# EAGLE design tree2 (EAGLE 9.6.0)
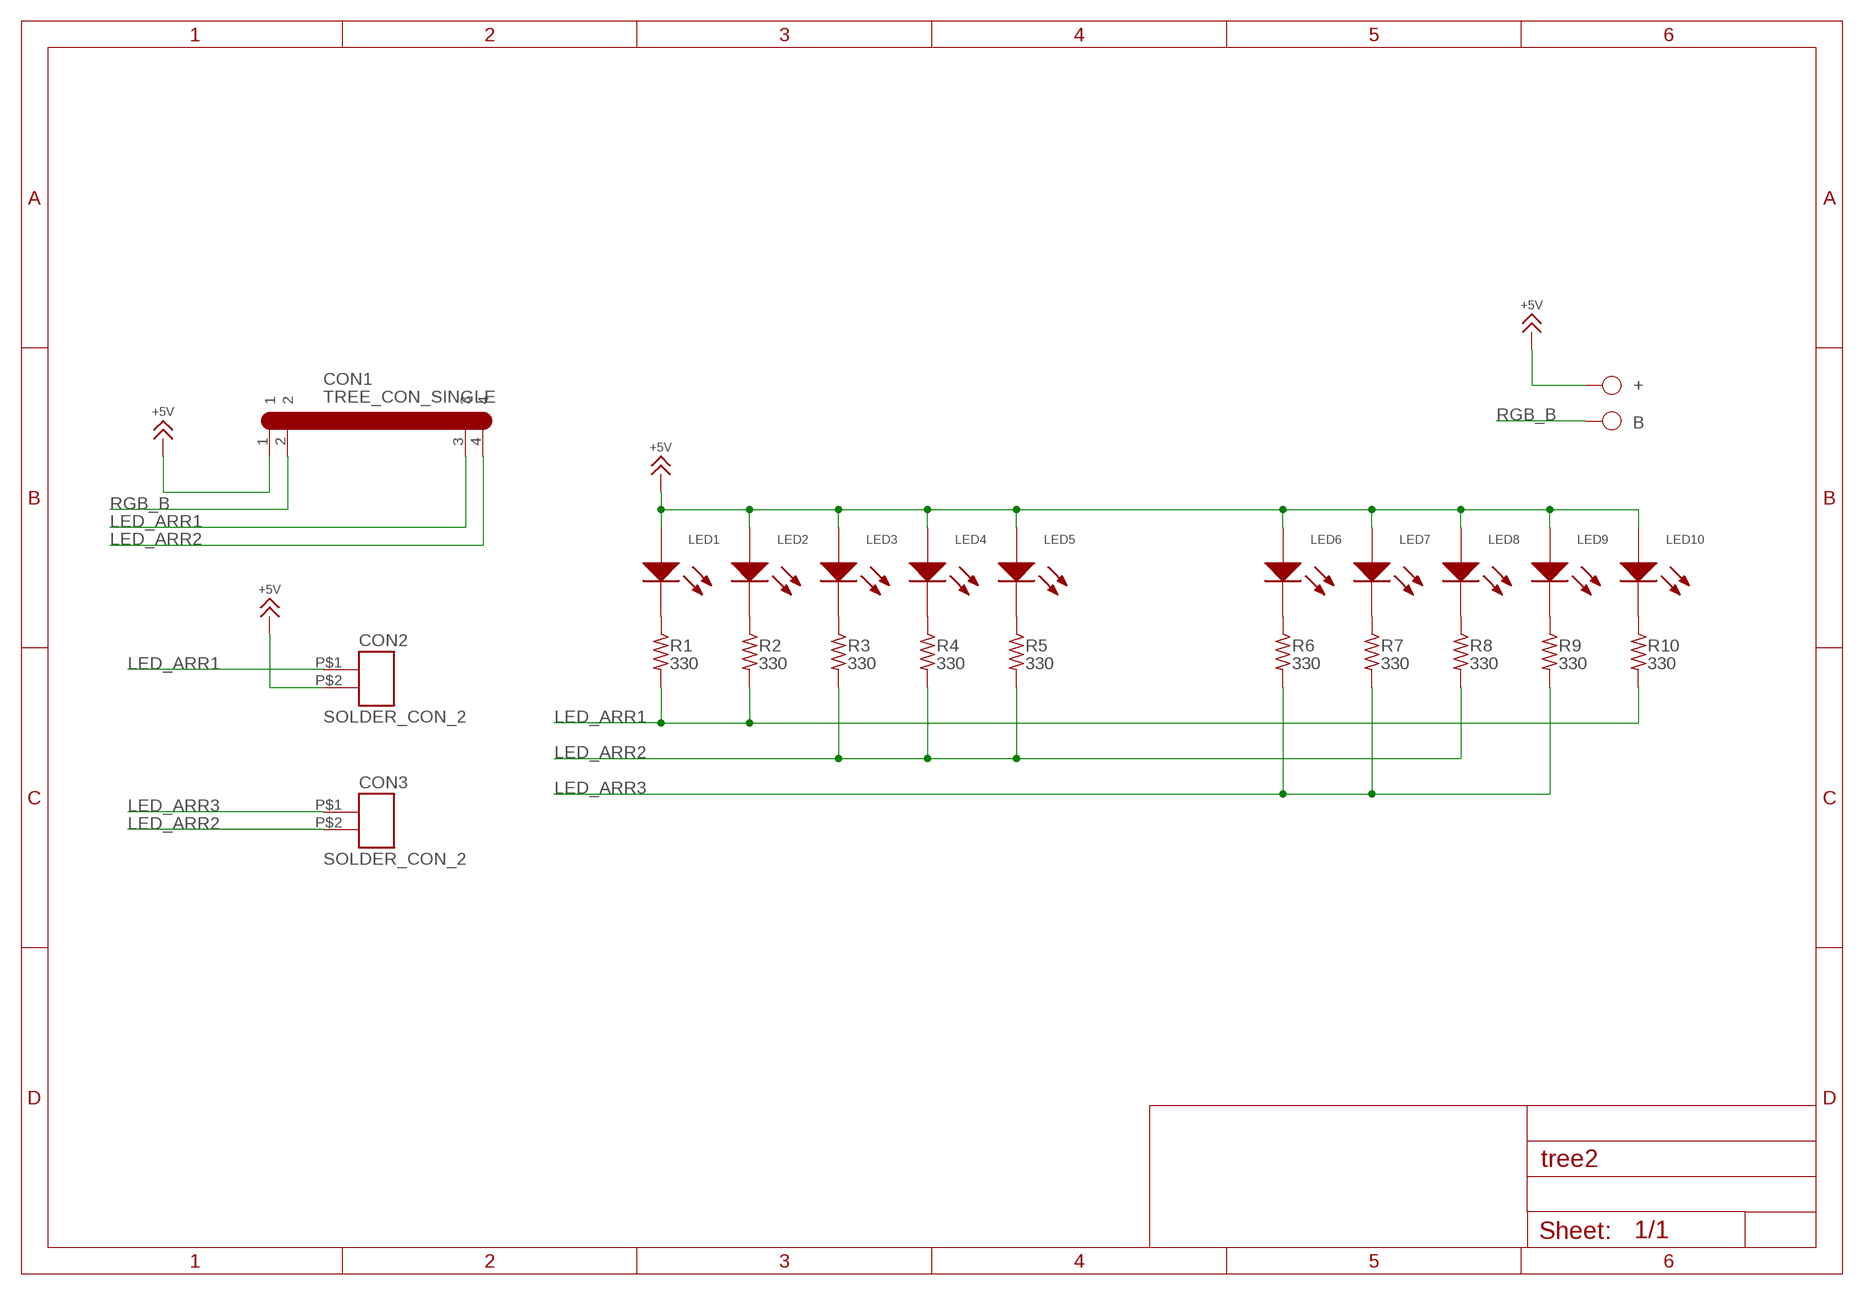
[diagram p0: schematic, sheet 1]

## Parts
+  TP  [TP]
B  TP  [TP]
CON1  TREE_CON_SINGLE  [TREE_CON_SINGLE]
CON2  SOLDER_CON_2  [SOLDER_CON_2]
CON3  SOLDER_CON_2  [SOLDER_CON_2]
LED1  LED_BEN  [LED_5MM_BEN]
LED2  LED_BEN  [LED_5MM_BEN]
LED3  LED_BEN  [LED_5MM_BEN]
LED4  LED_BEN  [LED_5MM_BEN]
LED5  LED_BEN  [LED_5MM_BEN]
LED6  LED_BEN  [LED_5MM_BEN]
LED7  LED_BEN  [LED_5MM_BEN]
LED8  LED_BEN  [LED_5MM_BEN]
LED9  LED_BEN  [LED_5MM_BEN]
LED10  LED_BEN  [LED_5MM_BEN]
R1  330  RES_2012  [SMD2012]
R2  330  RES_2012  [SMD2012]
R3  330  RES_2012  [SMD2012]
R4  330  RES_2012  [SMD2012]
R5  330  RES_2012  [SMD2012]
R6  330  RES_2012  [SMD2012]
R7  330  RES_2012  [SMD2012]
R8  330  RES_2012  [SMD2012]
R9  330  RES_2012  [SMD2012]
R10  330  RES_2012  [SMD2012]

## Nets
+5V [POWER]: +.1 CON1.1 CON2.P$2 LED1.1 LED2.1 LED3.1 LED4.1 LED5.1 LED6.1 LED7.1 LED8.1 LED9.1 LED10.1
LED_ARR1: CON1.3 CON2.P$1 R1.2 R2.2 R10.2
LED_ARR2: CON1.4 CON3.P$2 R3.2 R4.2 R5.2 R8.2
LED_ARR3: CON3.P$1 R6.2 R7.2 R9.2
N$1: LED1.2 R1.1
N$2: LED2.2 R2.1
N$3: LED3.2 R3.1
N$4: LED4.2 R4.1
N$5: LED5.2 R5.1
N$6: LED6.2 R6.1
N$7: LED7.2 R7.1
N$8: LED8.2 R8.1
N$9: LED9.2 R9.1
N$10: LED10.2 R10.1
RGB_B: B.1 CON1.2

## Library data of the parts
+ B = !JKS:TP
CON1 = !JKS:TREE_CON_SINGLE
CON2 CON3 = !JKS:SOLDER_CON_2
LED1-LED10 = !JKS:LED
R1-R10 = !JKS:RES

## Net classes
0 default: width 0.254 mm
1 POWER: width 0.3 mm

## Board
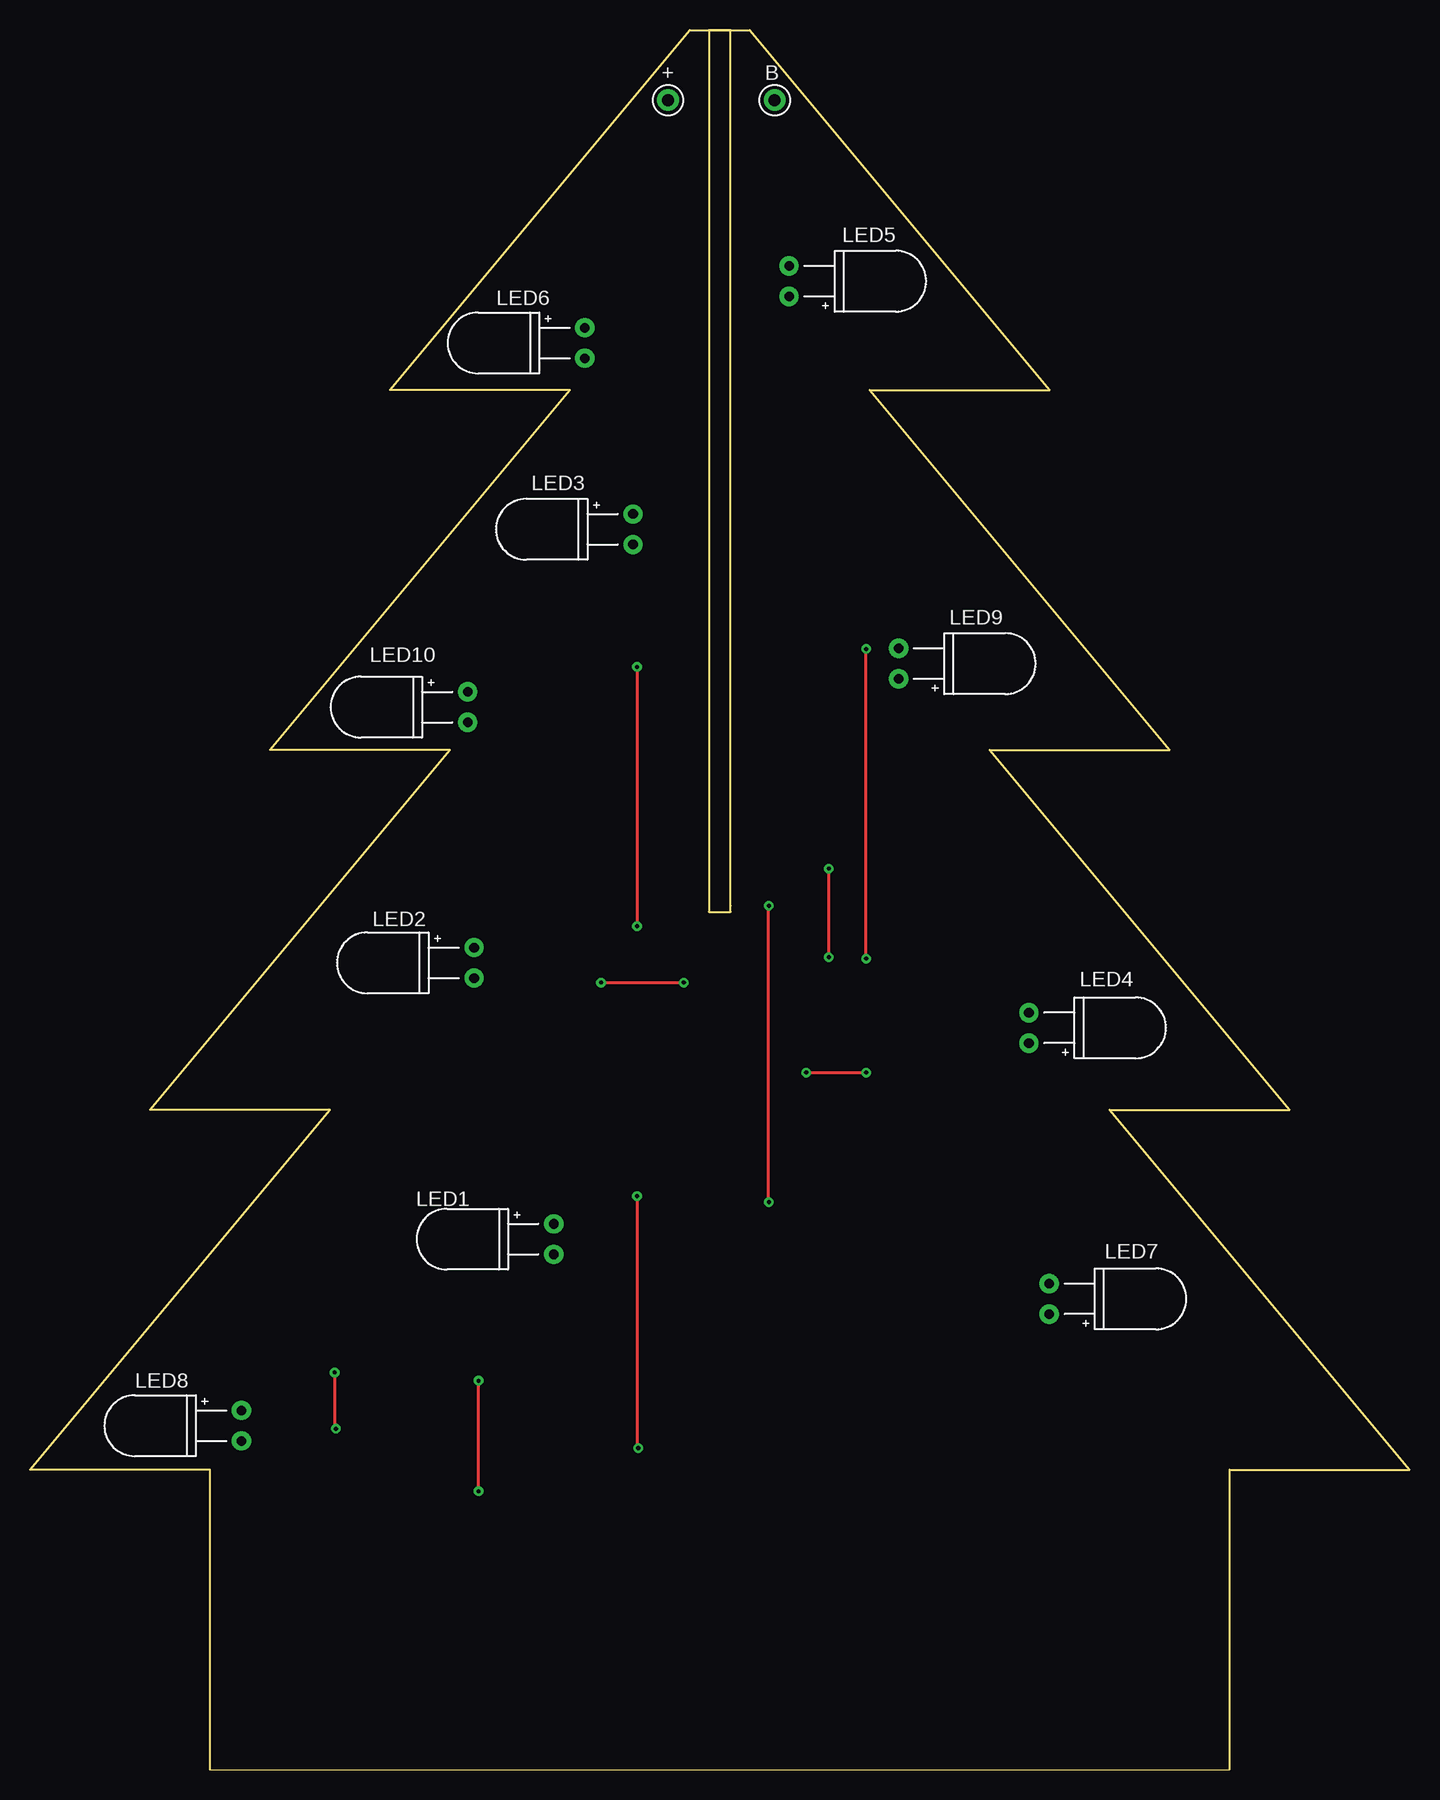
[diagram p1: board, top side]
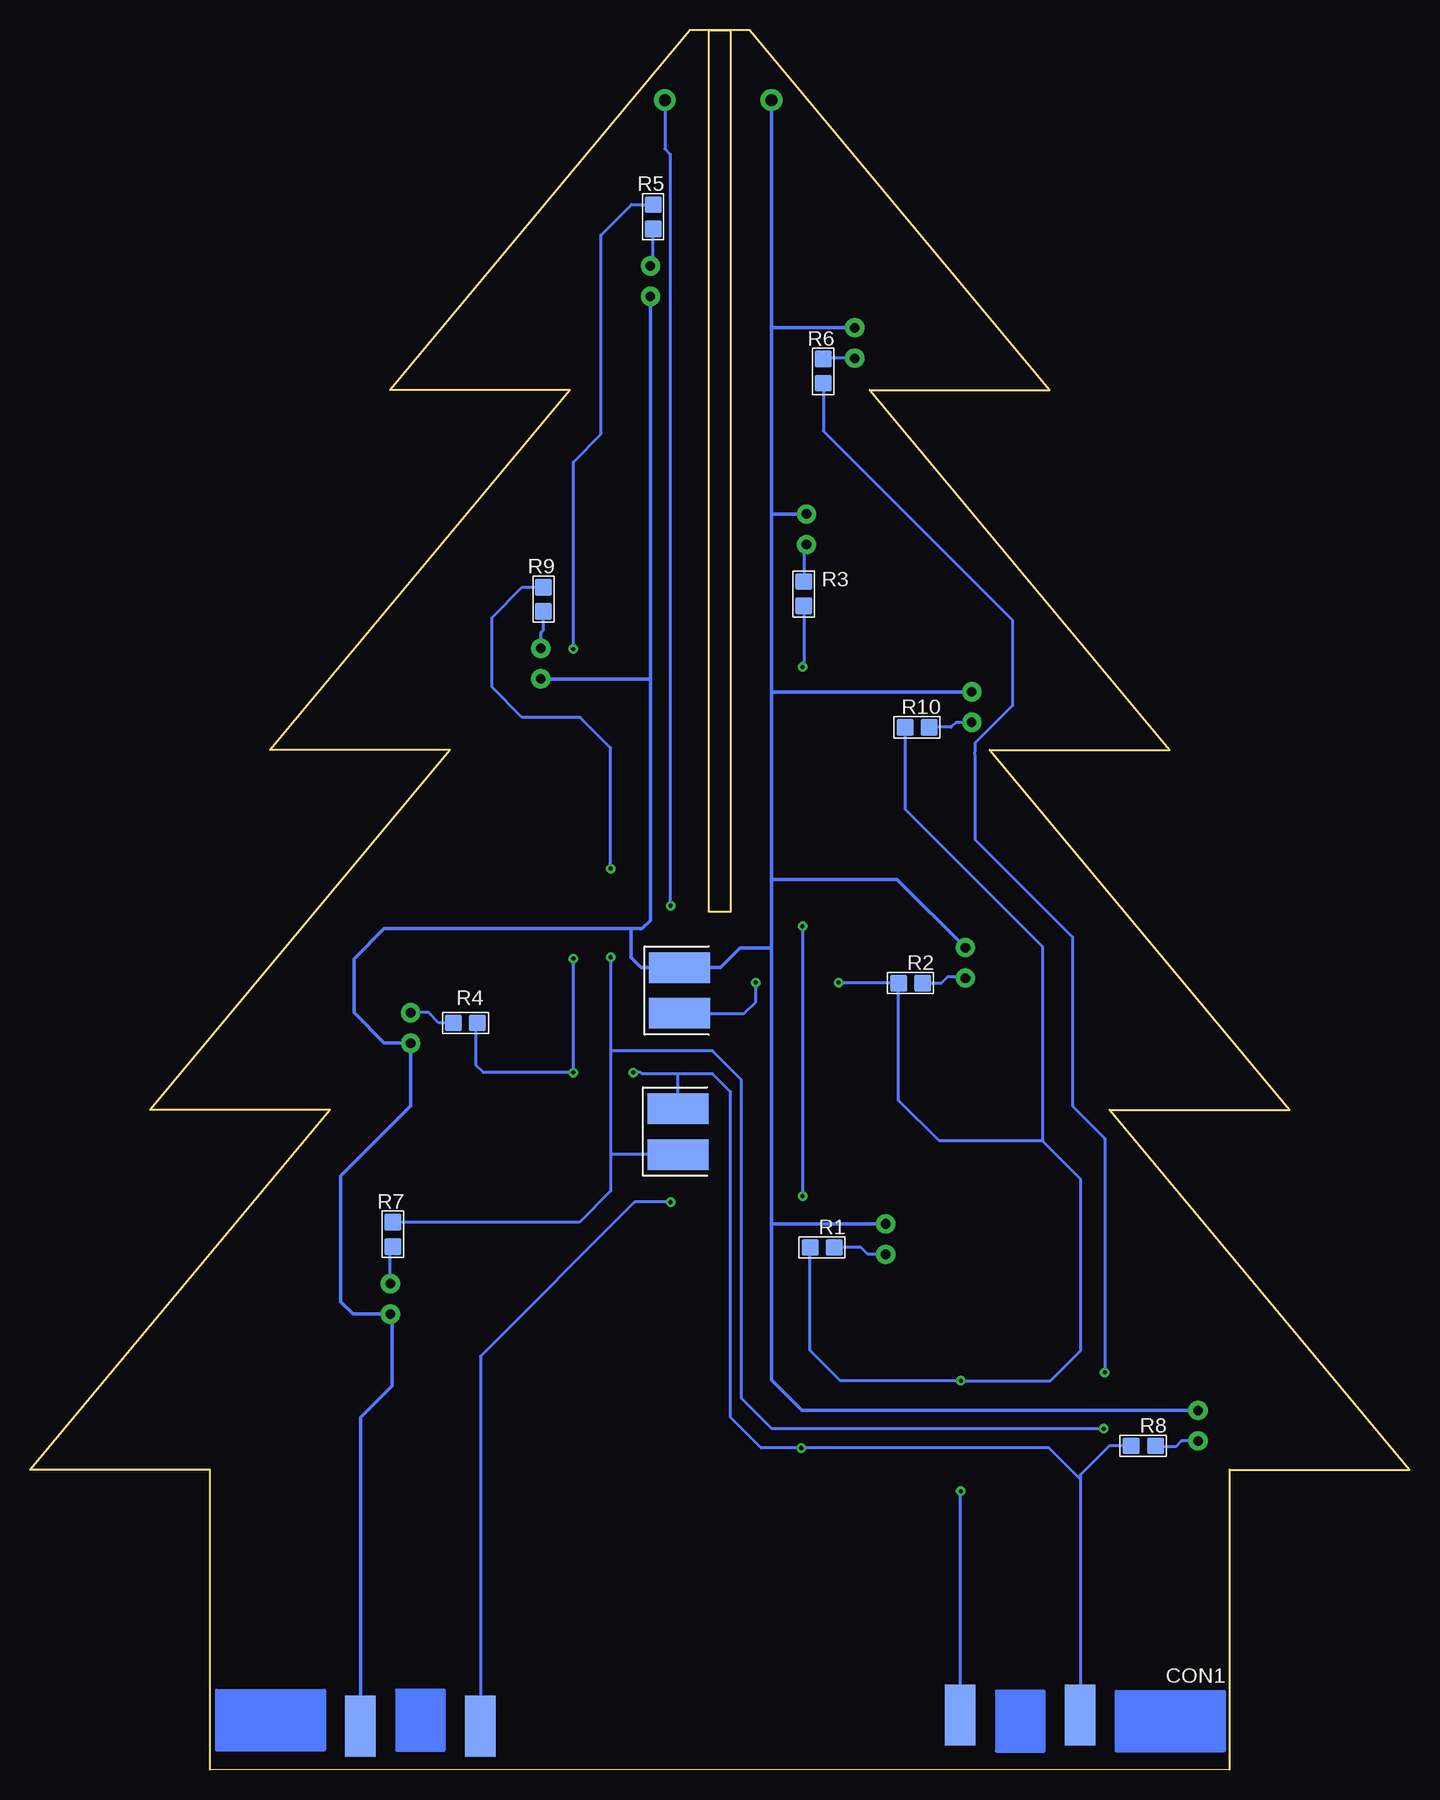
[diagram p2: board, bottom side, seen from below]

Size 115 x 145 mm. Coordinates in mm from the lower left corner, seen from the top.
Outline: 15,0 100,0 100,25 115,25 90,55 105,55 80,85 95,85 70,115 85,115 60,145 55,145 30,115 45,115 20,85 35,85 10,55 25,55 0,25 15,25 15,0
Copper layers (1*16): Top 0.035mm / dielectric 0.15mm / Bottom 0.035mm
Design rules "default *": minimum track width 10mil, minimum drill 0.35mm, track to track 10mil, track to pad 10mil, pad to pad 10mil, via to via 10mil, smd to smd 10mil, copper to edge 40mil, drill to drill 10mil, minimum pad ring 10mil, minimum via ring 8mil, stop-mask expansion 4mil, vias tented up to drill 0mil, thermal gap 10mil
Milling: 5 lines

### Footprints (pad centres in the part's own frame; a part is rotated, then mirrored left to right if it is on the bottom)
TP = drill 1 pad 1.8: 1 0,0
TREE_CON_SINGLE = smd 2.54 x 5.08: 1 -30,-3; 2 -20,-3; 3 20,-2.08; 4 30,-2.08
SOLDER_CON_2 = smd 2.54 x 5.08: P$1 0,0.635; P$2 3.81,0.635
LED_5MM_BEN = drill 0.8 pad 1.6: 1 0,0; 2 0,-2.54
SMD2012 = smd 1.4 x 1.4: 1 0,0; 2 2.019,0

### Placement (x,y rotation side)
+  53.19,139.15 0 top
B  62.08,139.15 0 top
CON1  57.45,6.62 0 bottom
CON2  60.21,63.03 90 bottom
CON3  60.34,51.27 90 bottom
LED1  43.66,45.48 0 top
LED2  37.02,68.51 0 top
LED3  50.27,104.65 0 top
LED4  83.27,60.55 180 top
LED5  63.28,122.79 180 top
LED6  46.25,120.18 0 top
LED7  84.96,37.96 180 top
LED8  17.63,29.93 0 top
LED9  72.41,90.91 180 top
LED10  36.49,89.83 0 top
R1  47.95,43.52 180 bottom
R2  40.57,65.56 180 bottom
R3  50.49,99.02 270 bottom
R4  79.72,62.23 0 bottom
R5  63.06,128.42 90 bottom
R6  48.87,117.58 270 bottom
R7  84.74,43.59 90 bottom
R8  21.18,26.98 180 bottom
R9  72.19,96.54 90 bottom
R10  40.04,86.88 180 bottom

### Tracks (layer width: path | path; a pad name or v marks a point on that pad's centre or on a via)
+5V
  Bottom 0.3: +.1 53.19,120.2 | 53.19,120.2 53.19,104.6 | 53.19,104.6 53.19,89.7 | 53.19,89.7 53.19,74.2 | 53.19,45.5 53.19,68.5 | LED10.1 53.06,89.83 53.19,89.7 | LED3.1 53.14,104.65 53.19,104.6 | LED6.1 53.17,120.18 53.19,120.2 | LED8.1 50.65,29.93 53.19,32.47 53.19,45.5 | 53.19,45.5 53.17,45.48 LED1.1 | LED5.1 63.28,90.9 | 63.28,90.9 63.28,70.78 63.96,70.1 64.9,70.1 | CON1.1 87.45,29.35 84.8,32 84.8,37.8 LED7.1 88.06,37.96 89.1,39 89.1,49.5 83.27,55.33 LED4.1 85.46,60.55 88,63.09 88,67.56 85.46,70.1 64.9,70.1 | LED9.1 63.29,90.91 63.28,90.9 | LED2.1 42.71,74.2 53.19,74.2 | 53.19,68.5 55.8,68.5 57.46,66.84 CON2.P$2 64.04,66.84 64.9,67.7 64.9,70.1 | 53.19,68.5 53.19,74.2
LED_ARR1  (via drill 0.35 pad 0.8)
  Top 0.254: v37.4,23.2 v37.4,32.4 | v47.6,65.6 v54.5,65.6
  Bottom 0.254: CON1.3 37.45,23.15 v37.4,23.2 | R1.2 49.97,34.94 47.43,32.4 v37.4,32.4 29.94,32.4 27.4,34.94 27.4,49.2 30.6,52.4 | 30.6,52.4 39.2,52.4 42.59,55.79 R2.2 42.63,65.6 v47.6,65.6 | R10.2 42.06,80.06 30.6,68.6 30.6,52.4 | CON2.P$1 55.47,63.03 54.5,64 v54.5,65.6
LED_ARR2  (via drill 0.35 pad 0.8)
  Top 0.254: v64.7,58.1 v69.7,58.1 | v50.6,91.9 v50.6,70.3 | v50.6,47.8 50.6,26.9 v50.7,26.8 | v69.7,67.6 v69.7,93.4
  Bottom 0.254: R8.2 25.02,26.98 27.45,24.55 27.45,24.2 | 27.45,24.2 CON1.4 | 27.45,24.2 30.05,26.8 v50.7,26.8 54.06,26.8 56.6,29.34 56.6,56.5 58.1,58 61,58 | v64.7,58.1 64.1,58.1 64,58 61,58 | R3.2 50.49,92.01 v50.6,91.9 | v50.6,70.3 v50.6,47.8 | v69.7,67.6 v69.7,58.1 77.2,58.1 77.8,58.7 77.8,62.13 R4.2 | v69.7,93.4 69.7,109 67.4,111.3 67.4,127.9 64.86,130.44 R5.2 | CON3.P$2 60.97,57.97 61,58
LED_ARR3  (via drill 0.35 pad 0.8)
  Top 0.254: v25.4,33.1 25.4,28.5 v25.5,28.4 | v66.6,67.7 v66.6,75.1
  Bottom 0.254: R7.2 69.2,45.61 66.6,48.21 66.6,51.2 | R6.2 48.87,111.57 33.1,95.8 33.1,88.68 36.22,85.56 36.22,85.06 36.26,84.61 36.22,84.56 36.22,77.52 28.1,69.4 28.1,55.3 25.4,52.6 v25.4,33.1 | v25.5,28.4 53.16,28.4 55.7,30.94 55.7,50.8 55.7,57.5 58.1,59.9 66.6,59.9 | v66.6,75.1 66.6,85.16 69.14,87.7 73.96,87.7 76.5,90.24 76.5,96.02 73.96,98.56 R9.2 | v66.6,67.7 66.6,59.9 | 66.6,59.9 66.6,51.2 | CON3.P$1 66.53,51.27 66.6,51.2
N$1
  Bottom 0.254: LED1.2 45.14,42.94 45.72,43.52 R1.1
N$2
  Bottom 0.254: R2.1 39.04,65.56 38.5,66.1 37.15,66.1 LED2.2
N$3
  Bottom 0.254: LED3.2 50.49,101.89 R3.1
N$4
  Bottom 0.254: R4.1 80.93,62.23 81.79,63.09 LED4.2
N$5
  Bottom 0.254: LED5.2 63.06,125.55 R5.1
N$6
  Bottom 0.254: LED6.2 48.81,117.64 R6.1
N$7
  Bottom 0.254: LED7.2 84.96,43.37 R7.1
N$8
  Bottom 0.254: LED8.2 19.01,27.39 19.5,26.9 21.1,26.9 R8.1
N$9
  Bottom 0.254: LED9.2 72.41,94.79 72.19,95.01 R9.1
N$10
  Bottom 0.254: LED10.2 37.81,87.29 38.22,86.88 R10.1
RGB_B  (via drill 0.35 pad 0.8)
  Top 0.254: v61.6,72 61.5,71.9 61.5,47.4 v61.6,47.3
  Bottom 0.254: v61.6,47.3 64.6,47.3 77.45,34.45 CON1.2 | B.1 62.08,135.1 61.6,134.62 v61.6,72